# EAGLE design Archer (EAGLE 9.6.2)
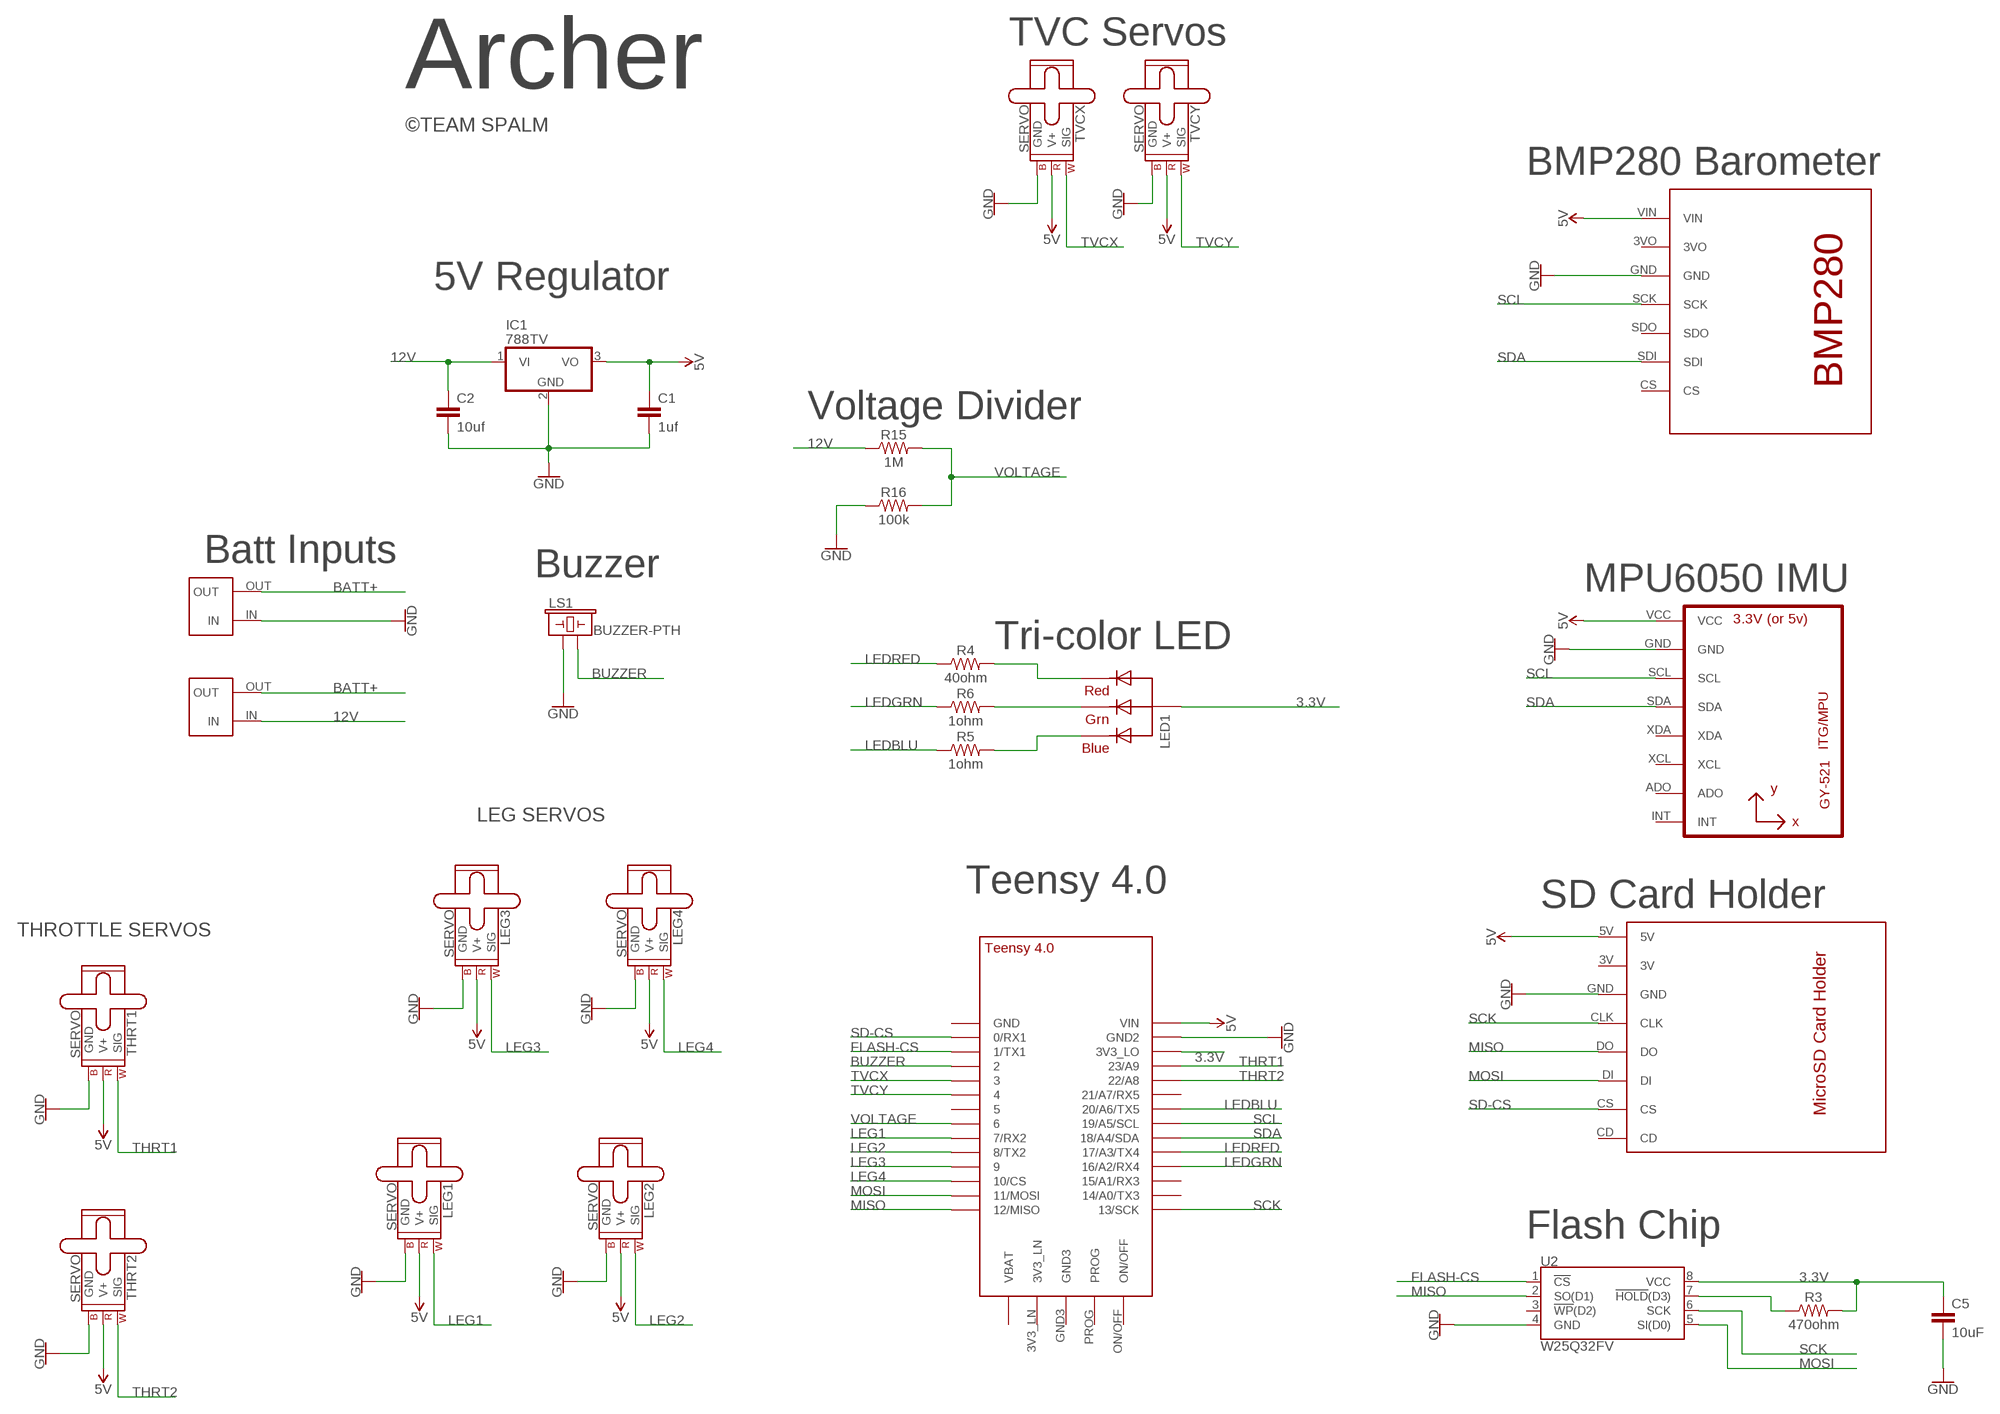
[diagram p0: schematic, sheet 1]

## Parts
C1  1uf  22PF-PTH-2.54MM-200V-5%  [CAP-PTH-2.54]
C2  10uf  22PF-PTH-2.54MM-200V-5%  [CAP-PTH-2.54]
C5  10uF  22PF-PTH-2.54MM-200V-5%  [CAP-PTH-2.54]
IC1  788TV  [TO220V]
LED1  RGBLED_CA-5MM  [LED5MMRGB]
LEG1  SERVO  [1X03]
LEG2  SERVO  [1X03]
LEG3  SERVO  [1X03]
LEG4  SERVO  [1X03]
LS1  BUZZER-PTH  [BUZZER-12MM]
R3  470ohm  10MOHM-HORIZ-1/4W-5%  [AXIAL-0.3]
R4  40ohm  10MOHM-HORIZ-1/4W-5%  [AXIAL-0.3]
R5  1ohm  10MOHM-HORIZ-1/4W-5%  [AXIAL-0.3]
R6  1ohm  10MOHM-HORIZ-1/4W-5%  [AXIAL-0.3]
R15  1M  10MOHM-HORIZ-1/4W-5%  [AXIAL-0.3]
R16  100k  10MOHM-HORIZ-1/4W-5%  [AXIAL-0.3]
TEENSY_4.0  TEENSY_4.0  [TEENSY_4.0]
THRT1  SERVO  [1X03]
THRT2  SERVO  [1X03]
TVCX  SERVO  [1X03]
TVCY  SERVO  [1X03]
U1  GY-521MPU6050  [GY-521]
U2  W25Q32FV  W25Q32FVSS  [SOIC-8]
U$2  BMP280  [BMP280]
U$3  MICROSDCARDHOLDER  [SDCARDHOLDER]
U$8  BLACKTERMBLOCK  [BLACKTERMBLOCK]
U$9  BLACKTERMBLOCK  [BLACKTERMBLOCK]

## Nets
3.3V: C5.1 LED1.2(VCC) R3.P$2 TEENSY_4.0.3V3_LO U2.8(VCC)
5V: C1.1 IC1.3(VO) LEG1.2(V+) LEG2.2(V+) LEG3.2(V+) LEG4.2(V+) TEENSY_4.0.VIN THRT1.2(V+) THRT2.2(V+) TVCX.2(V+) TVCY.2(V+) U1.VCC U$2.VIN U$3.5V
12V: C2.1 IC1.1(VI) R15.P$1 U$9.IN
BATT+: U$8.OUT U$9.OUT
BUZZER: LS1.- TEENSY_4.0.2
FLASH-CS: TEENSY_4.0.1/TX(1/TX1) U2.1(!CS!)
GND: C1.2 C2.2 C5.2 IC1.2(GND) LEG1.3(GND) LEG2.3(GND) LEG3.3(GND) LEG4.3(GND) LS1.+ R16.P$1 TEENSY_4.0.GND2 THRT1.3(GND) THRT2.3(GND) TVCX.3(GND) TVCY.3(GND) U1.GND U2.4(GND) U$2.GND U$3.GND U$8.IN
LEDBLU: R5.P$1 TEENSY_4.0.20/A6(20/A6/TX5)
LEDGRN: R6.P$1 TEENSY_4.0.16/A2(16/A2/RX4)
LEDRED: R4.P$1 TEENSY_4.0.17/A3(17/A3/TX4)
LEG1: LEG1.1(SIG) TEENSY_4.0.7(7/RX2)
LEG2: LEG2.1(SIG) TEENSY_4.0.8(8/TX2)
LEG3: LEG3.1(SIG) TEENSY_4.0.9/CS
LEG4: LEG4.1(SIG) TEENSY_4.0.10/CS
MISO: TEENSY_4.0.12/MISO U2.2(SO(D1)) U$3.DO
MOSI: TEENSY_4.0.11/MOSI U2.5(SI(D0)) U$3.DI
N$1: LED1.1(RED) R4.P$2
N$2: R3.P$1 U2.7(!HOLD!(D3))
N$3: LED1.3(GREEN) R6.P$2
N$4: LED1.4(BLUE) R5.P$2
SCK: TEENSY_4.0.13/SCK U2.6(SCK) U$3.CLK
SCL: TEENSY_4.0.19/A5/SCL U1.SCL U$2.SCK
SD-CS: TEENSY_4.0.0/RX(0/RX1) U$3.CS
SDA: TEENSY_4.0.18/A4/SDA U1.SDA U$2.SDI
THRT1: TEENSY_4.0.23/A9 THRT1.1(SIG)
THRT2: TEENSY_4.0.22/A8 THRT2.1(SIG)
TVCX: TEENSY_4.0.3/CANTX TVCX.1(SIG)
TVCY: TEENSY_4.0.4/CANRX TVCY.1(SIG)
VOLTAGE: R15.P$2 R16.P$2 TEENSY_4.0.6
Unconnected: TEENSY_4.0.3V3_LN TEENSY_4.0.5 TEENSY_4.0.14/A0(14/A0/TX3) TEENSY_4.0.15/A1(15/A1/RX3) TEENSY_4.0.21/A7(21/A7/RX5) TEENSY_4.0.GND TEENSY_4.0.GND3 TEENSY_4.0.ON/OFF TEENSY_4.0.PROG TEENSY_4.0.VBAT\(VBAT) U1.ADO U1.INT U1.XCL U1.XDA U2.3(!WP!(D2)) U$2.3VO U$2.CS U$2.SDO U$3.3V U$3.CD

## Notes on the sheet
- TVC Servos
- Archer
- ©TEAM SPALM
- BMP280 Barometer
- 5V Regulator
- Voltage Divider
- Batt Inputs
- Buzzer
- MPU6050 IMU
- Tri-color LED
- LEG SERVOS
- Teensy 4.0
- SD Card Holder
- THROTTLE SERVOS
- Flash Chip

## Library data of the parts
C1 C2 C5 = SparkFun-Capacitors:22PF: 22pF ceramic capacitors A capacitor is a passive two-terminal electrical component used to store electrical energy temporarily in an electric field.; PROD_ID: CAP-09128; VALUE: 22pF
IC1 = linear:78*: Positive VOLTAGE REGULATOR Source: http://cache.national.com/ds/LM/LM78L05.pdf http://www.fairchildsemi.com/ds/LM/LM7805.pdf
LED1 = adafruit:RGBLED_CA: RGB LED, common-anode 5MM Staggered pins 5mm Piranha package http://www.ladyada.net/library/pcb/eaglelibrary.html
LEG1-LEG4 THRT1 THRT2 TVCX TVCY = SparkFun-Electromechanical:SERVO: Servo Motor 3-pin connector for a standard servo motor (voltage supply, ground, and control signal.) SparkFun Products Servo - Generic (Sub-Micro Size) <https://www.sparkfun.com/products/9065> (ROB-09065) Servo - Generic High Torque Continuous Rotation (Standard Size) <https://www.sparkfun.com/products/9347> (ROB-09347) Servo - Generic High Torque (Standard Size) <https://www.sparkfun.com/products/11965> (ROB-11965)
LS1 = SparkFun-Electromechanical:BUZZER: Buzzer Small round buzzers that operate around the audible 2kHz range. You can use these as speakers to create simple music or user interfaces. Variant Overview: PTH - Mini Speaker - PC Mount 12mm 2.048kHz <https://www.sparkfun.com/products/7950> PTH_KIT - Mini Speaker - PC Mount 12mm 2.048kHz <https://www.sparkfun.com/products/7950> KIT simplifies soldering by adding stop mask to one side of the pads. PTH_NO_SILK - Mini Speaker - PC Mount 12mm 2.048kHz <https://www.sparkfun.com/products/7950> No silkscreen indicator of buzzer outline. PTH_KIT_NO_SILK - Mini Speaker - PC Mount 12mm 2.048kHz <https://www.sparkfun.com/products/7950> KIT package w/o silkscreen SMD - Buzzer Audio Magnetic (CCV-084B16) SMD buzzer used on, e.g. the LilyPad Buzzer <https://www.sparkfun.com/products/8463> and RFID USB Reader <https://www.sparkfun.com/products/9963>. SMD_KIT - Buzzer Audio Magnetic (CCV-084B16) SMD Buzzer with elongated pins to make soldering easier. Used on the SparkFun Simon Says - Surface Mount Soldering Kit <https://www.sparkfun.com/products/10935>.; PROD_ID: COMP-08253; SF_SKU: COM-07950
R3-R6 R15 R16 = SparkFun-Resistors:10MOHM: RES-09327; PROD_ID: RES-09327; VALUE: 10M
TEENSY_4.0 = TEENSY 4.0:TEENSY_4.0
U1 = gy-521:GY-521
U2 = SparkFun-IC-Memory:W25Q32FV: W25Q32FV 32Mb (4MB) Serial Flash Memory The W25Q32FV support the standard Serial Peripheral Interface (SPI), Dual/Quad I/O SPI as well as 2-clocks instruction cycle Quad Peripheral Interface (QPI). 104MHz, SPI, 8-SOIC-EIAJ Datasheet <http://www.winbond.com/resource-files/w25q32fv%20revh%20091613.pdf> SparkFun Products SparkFun Blynk Board - ESP8266 <https://www.sparkfun.com/products/13794> (WRL-13794); PROD_ID: IC-13229
U$2 = BMP280:BMP280
U$3 = SDCardHolder:MICROSDCARDHOLDER
U$8 U$9 = BlackTermBlock:BLACKTERMBLOCK

## Board
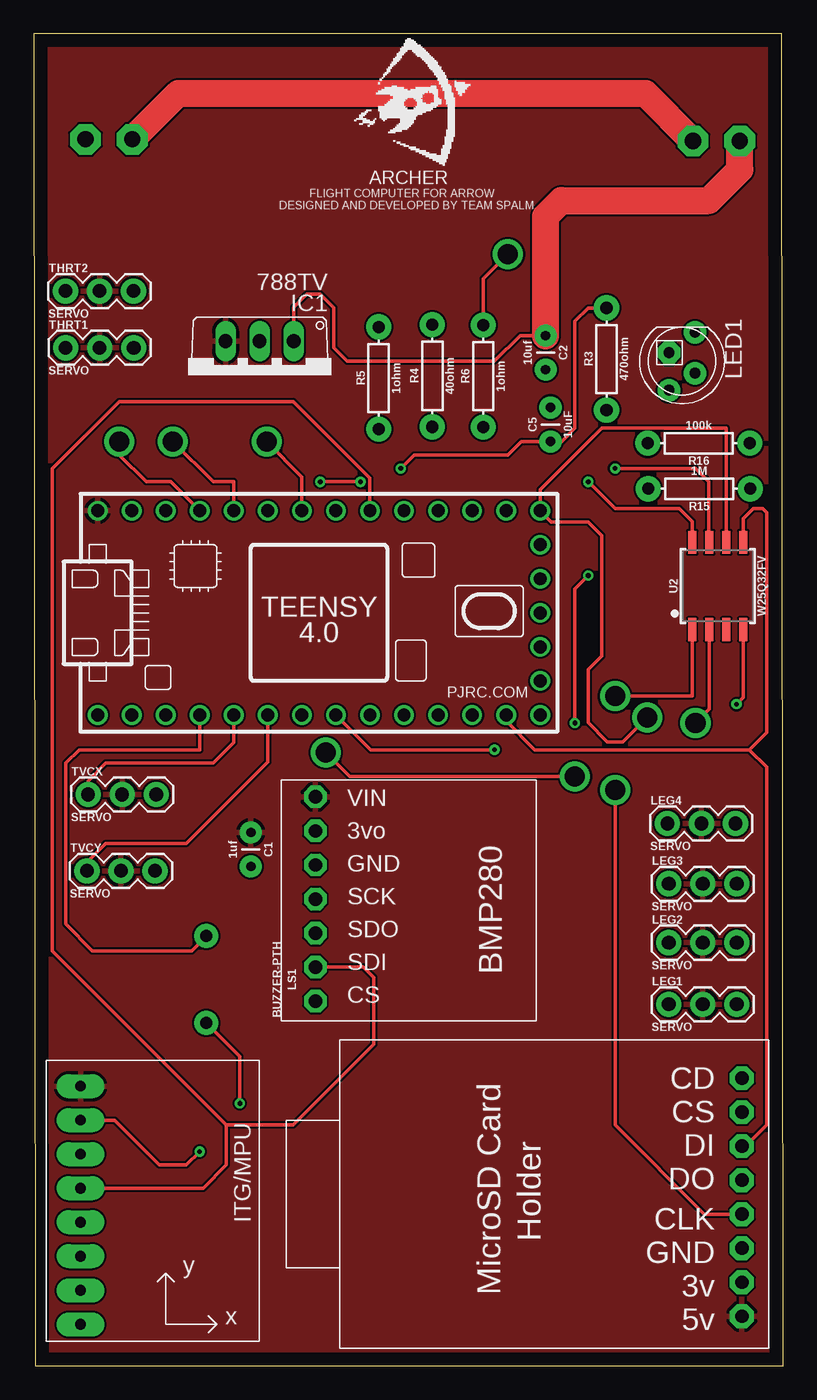
[diagram p1: board, top side]
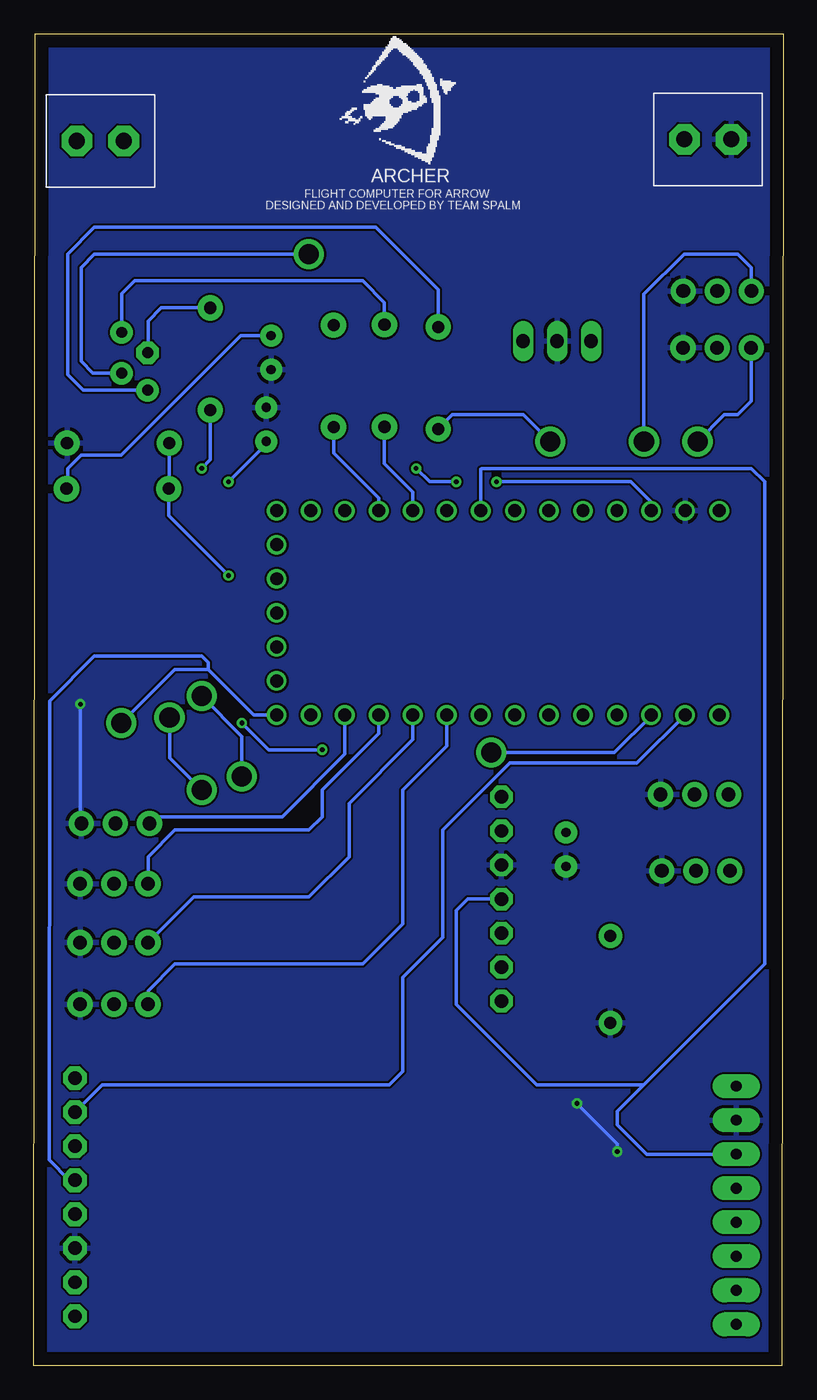
[diagram p2: board, bottom side, seen from below]

Size 55.95 x 99.46 mm. Coordinates in mm from the lower left corner, seen from the top.
Outline: 0.13,0 55.95,0 55.82,99.46 0,99.46 0.13,0
Copper layers (1*16): Top 0.035mm / dielectric 1.5mm / Bottom 0.035mm
Design rules "default": minimum track width 6mil, minimum drill 0.35mm, track to track 6mil, track to pad 6mil, pad to pad 6mil, via to via 6mil, smd to smd 6mil, copper to edge 40mil, drill to drill 6mil, minimum pad ring 10mil, minimum via ring 8mil, stop-mask expansion 4mil, vias tented up to drill 0mil, thermal gap 10mil

### Footprints (pad centres in the part's own frame; a part is rotated, then mirrored left to right if it is on the bottom)
CAP-PTH-2.54 = drill 0.7 pad 1.651: 1 -1.27,0; 2 1.27,0
TO220V = drill 1.016 long: 1 -2.54,-2.54; 2 0,-2.54; 3 2.54,-2.54
LED5MMRGB = drill 0.8 pad 1.676: 1 -2.159,0.968; 3 0.889,0.968; 4 2.159,-0.968 | drill 0.8 pad 1.676 octagon: 2 -0.635,-0.968
1X03 = drill 1.016 pad 1.88: 1 0,0; 2 2.54,0; 3 5.08,0
BUZZER-12MM = drill 0.9 pad 1.778: + 3.25,0; - -3.25,0
AXIAL-0.3 = drill 0.9 pad 1.88: P$1 -3.81,0; P$2 3.81,0
TEENSY_4.0 = drill 0.965: 0/RX -13.97,-7.62; 1/TX -11.43,-7.62; 2 -8.89,-7.62; 3/CANTX -6.35,-7.62; 3V3_LN 16.51,-2.54; 3V3_LO -11.43,7.62; 4/CANRX -3.81,-7.62; 5 -1.27,-7.62; 6 1.27,-7.62; 7 3.81,-7.62; 8 6.35,-7.62; 9/CS 8.89,-7.62; 10/CS 11.43,-7.62; 11/MOSI 13.97,-7.62; 12/MISO 16.51,-7.62; 13/SCK 16.51,7.62; 14/A0 13.97,7.62; 15/A1 11.43,7.62; 16/A2 8.89,7.62; 17/A3 6.35,7.62; 18/A4/SDA 3.81,7.62; 19/A5/SCL 1.27,7.62; 20/A6 -1.27,7.62; 21/A7 -3.81,7.62; 22/A8 -6.35,7.62; 23/A9 -8.89,7.62; GND -16.51,-7.62; GND2 -13.97,7.62; GND3 16.51,0; ON/OFF 16.51,5.08; PROG 16.51,2.54; VBAT\ 16.51,-5.08; VIN -16.51,7.62
GY-521 = drill 0.8 pad 1.778 long: ADO -8.89,-6.35; GND -8.89,6.35; INT -8.89,-8.89; SCL -8.89,3.81; SDA -8.89,1.27; VCC -8.89,8.89; XCL -8.89,-3.81; XDA -8.89,-1.27
SOIC-8 = smd 0.61 x 1.702: 1 -1.905,-3.251; 2 -0.635,-3.251; 3 0.635,-3.251; 4 1.905,-3.251; 5 1.905,3.251; 6 0.635,3.251; 7 -0.635,3.251; 8 -1.905,3.251
BMP280 = drill 1 pad 1.676 octagon: 3VO 3.81,2.54; CS 16.51,2.54; GND 6.35,2.54; SCK 8.89,2.54; SDI 13.97,2.54; SDO 11.43,2.54; VIN 1.27,2.54
SDCARDHOLDER = drill 1 pad 1.778 octagon: 3V -5.08,0; 5V -7.62,0; CD 10.16,0; CLK 0,0; CS 7.62,0; DI 5.08,0; DO 2.54,0; GND -2.54,0
BLACKTERMBLOCK = drill 1.2 pad 2.3 octagon: IN 0,0; OUT 3.5,0

### Placement (x,y rotation side)
C1  16.22,38.56 270 top
C2  38.22,75.64 270 top
C5  38.58,70.28 90 top
IC1  16.88,73.96 180 top
LED1  48.4,75 270 top
LEG1  47.4,27 0 top
LEG2  47.4,31.6 0 top
LEG3  47.4,36 0 top
LEG4  47.3,40.5 0 top
LS1  12.9,28.85 270 top
R3  42.76,75.17 90 top
R4  29.76,73.91 90 top
R5  25.76,73.75 90 top
R6  33.56,73.89 90 top
R15  49.68,65.48 180 top
R16  49.64,68.88 180 top
TEENSY_4.0  21.3,56.22 0 top
THRT1  2.4,76 0 top
THRT2  2.39,80.24 0 top
TVCX  4.08,42.66 0 top
TVCY  3.99,36.96 0 top
U1  12.4,12 0 top
U2  51.06,58.23 0 top
U$2  18.5,43.75 270 top
U$3  52.86,11.33 90 top
U$8  3.88,91.56 0 top
U$9  52.71,91.44 180 top

### Tracks (layer width: path | path; a pad name or v marks a point on that pad's centre or on a via)
3.3V  (via drill 0.35)
  Top 0.25: U2.8 49.15,63.05 48.2,64 43.4,64 v41.4,66 | v21.4,66 v24.4,66 | v27.4,67 28.4,68 35.4,68 36.41,69.01 C5.1 39.41,69.01 40.4,70 40.4,78 41.38,78.98 R3.P$2
  Bottom 0.25: LED1.2 47.4,75.67 47.4,78 46.4,79 42.78,79 R3.P$2 | v41.4,66 38.58,68.82 C5.1 | TEENSY_4.0.3V3_LO 9.87,64.47 11.4,66 v21.4,66 | v24.4,66 26.4,66 v27.4,67
5V
  pour Top: -11.6,103 61.4,103 61.4,-4 -11.6,-4
12V
  Top 0.25: C2.1 36.31,76.91 34.4,75 23.4,75 22.4,76 22.4,79 21.4,80 20.4,80 19.42,79.02 IC1.1
  Top 2: C2.1 38.22,85.82 39.4,87 50.4,87 52.71,89.31 U$9.IN
  Bottom 0.25: R15.P$1 53.4,65.57 53.4,67 52.4,68 49.4,68 40.49,76.91 C2.1
BATT+
  Top 2: U$8.OUT 10.82,95 45.65,95 U$9.OUT
BUZZER
  Top 0.25: TEENSY_4.0.2 12.41,46.01 12.4,46 3.4,46 2.4,45 2.4,33 4.4,31 11.8,31 LS1.-
FLASH-CS  (via drill 1.5)
  Top 0.25: v21.8,45.8 23.6,44 v40.4,44 | v43.4,50 49.15,50 U2.1
  Bottom 0.25: TEENSY_4.0.1/TX 9.87,48.53 12.6,45.8 v21.8,45.8 | v43.4,50 40.4,47 v40.4,44
GND  (via drill 0.35)
  Top 0.25: LS1.+ 15.4,23.1 v15.4,19.6 | v12.4,16 11.4,15 9.4,15 6.05,18.35 U1.GND | U2.4 52.96,49.91 v52.45,49.4
  Bottom 0.25: v15.4,19.6 12.4,16.6 v12.4,16 | v52.45,49.4 52.45,40.57 LEG4.3
  pour Bottom: -18.6,106 69.4,106 69.4,-11 -18.6,-11
LEDBLU  (via drill 1.5)
  Top 0.25: TEENSY_4.0.20/A6 20.03,66.37 v17.4,69
  Bottom 0.25: v17.4,69 19.4,71 24.7,71 R5.P$1
LEDGRN
  Bottom 0.25: TEENSY_4.0.16/A2 30.19,64.79 33.56,68.16 R6.P$1
LEDRED
  Bottom 0.25: TEENSY_4.0.17/A3 27.65,65.25 29.76,67.36 R4.P$1
LEG1
  Bottom 0.25: TEENSY_4.0.7 25.11,46.29 28.4,43 28.4,33 31.4,30 45.4,30 47.4,28 LEG1.1
LEG2
  Bottom 0.25: TEENSY_4.0.8 27.65,46.75 32.4,42 32.4,38 35.4,35 43.4,35 44,35 LEG2.1
LEG3
  Bottom 0.25: TEENSY_4.0.9/CS 30.19,47.21 34.4,43 34.4,41 35.4,40 45.4,40 47.4,38 LEG3.1
LEG4
  Bottom 0.25: TEENSY_4.0.10/CS 32.73,45.67 37.4,41 46.8,41 LEG4.1
MISO  (via drill 1.5)
  Top 0.25: v49.4,48 50.42,49.02 U2.2
  Bottom 0.25: U$3.DO 53.27,13.87 54.79,15.39 54.79,16 54.74,49.65 51.4,53 43.4,53 42.91,52.51 42.91,52 | 42.91,52 39.51,48.6 TEENSY_4.0.12/MISO | v49.4,48 45.4,52 42.91,52
MOSI
  Top 0.25: TEENSY_4.0.11/MOSI 35.27,48.13 37.4,46 53.4,46 | 53.4,46 54.7,44.7 54.7,18 53.11,16.41 U$3.DI | 52.98,61.48 U2.5 52.96,63.27 53.7,64 54.4,64 54.7,63.7 54.7,47.3 53.4,46
N$1
  Bottom 0.25: LED1.1 49.37,80.03 48.4,81 31.4,81 29.76,79.36 R4.P$2
N$2  (via drill 0.35)
  Top 0.25: U2.7 50.4,61.51 50.4,66 49.4,67 v43.4,67
  Bottom 0.25: v43.4,67 42.76,67.64 R3.P$1
N$3  (via drill 1.5)
  Top 0.25: v35.4,83 33.56,81.16 R6.P$2
  Bottom 0.25: LED1.3 51.51,74.11 52.4,75 52.4,82 51.4,83 v35.4,83
N$4
  Bottom 0.25: LED1.4 52.24,72.84 53.4,74 53.4,83 51.4,85 30.4,85 25.76,80.36 R5.P$2
SCK  (via drill 1.5)
  Top 0.25: U2.6 51.69,70 42.4,70 37.81,65.41 TEENSY_4.0.13/SCK 38.65,63 41.4,63 42.4,62 42.4,53 41.4,52 41.4,48.02 42.82,46.6 43.98,46.6 45.78,48.4 v45.8,48.4 | v43.4,43 43.4,18 50.07,11.33 U$3.CLK
  Bottom 0.25: v45.8,48.4 45.8,45.4 v43.4,43
SCL
  Bottom 0.25: TEENSY_4.0.19/A5/SCL 22.57,66.94 22.51,67 2.4,67 1.4,66 1.4,30 10.4,21 | 10.4,21 12.4,19 12.4,18 10.21,15.81 U1.SCL | U$2.SCK 23.54,34.86 24.4,34 24.4,27 18.4,21 10.4,21
SD-CS
  Bottom 0.25: TEENSY_4.0.0/RX 10.93,45 20.4,45 25.4,40 25.4,32 28.4,29 28.4,22 29.4,21 50.81,21 U$3.CS
SDA
  Top 0.25: TEENSY_4.0.18/A4/SDA 25.11,66.29 19.4,72 6.4,72 1.4,67 1.4,31 14.4,18 | 14.4,18 14.4,15 12.67,13.27 U1.SDA | U$2.SDI 24.62,29.78 25.4,29 25.4,24 19.4,18 14.4,18
THRT1  (via drill 1.5)
  Top 0.25: TEENSY_4.0.23/A9 10.25,66 8.4,66 6.4,68 v6.4,69
  Bottom 0.25: v6.4,69 4.4,71 3.4,71 2.38,72.02 2.38,75.98 THRT1.1
THRT2  (via drill 1.5)
  Top 0.25: TEENSY_4.0.22/A8 14.95,66 13.4,66 v10.4,69
  Bottom 0.25: THRT2.1 2.39,81.99 3.4,83 7.4,83 10.4,80 v10.4,69
TVCX
  Top 0.25: TEENSY_4.0.3/CANTX 14.95,46.55 13.4,45 5.4,45 4.08,43.68 TVCX.1
TVCY
  Top 0.25: TEENSY_4.0.4/CANRX 17.49,45.09 11.4,39 5.4,39 3.99,37.59 TVCY.1
VOLTAGE  (via drill 0.35)
  Top 0.25: TEENSY_4.0.6 25.17,46 v34.4,46 | v40.4,48 40.4,58 v41.4,59
  Bottom 0.25: v34.4,46 38.4,46 v40.4,48 | v41.4,59 45.87,63.47 R15.P$2 45.83,65.52 R16.P$2

### Text on the board
tNames: ARCHER | FLIGHT COMPUTER FOR ARROW | DESIGNED AND DEVELOPED BY TEAM SPALM
bNames: ARCHER | FLIGHT COMPUTER FOR ARROW | DESIGNED AND DEVELOPED BY TEAM SPALM